# Altium schematic sheet control_logic.SchDoc
size Letter
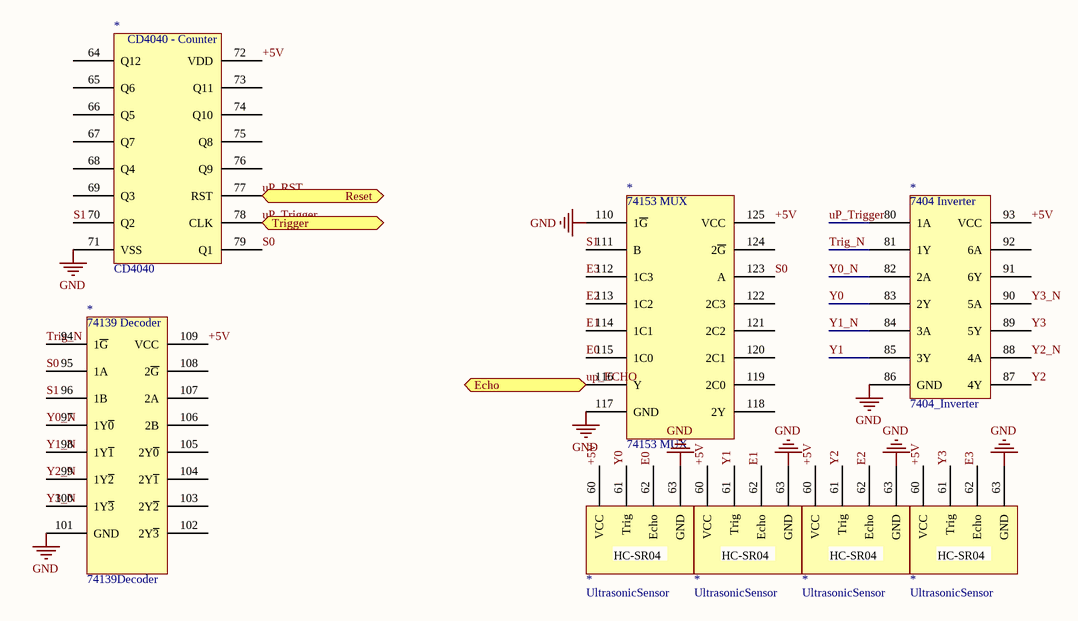
[diagram p0: control_logic.SchDoc]

## Parts
(Parts that share a designator on the sheet are numbered #1, #2 ... from top to bottom, then left to right.)
*#1  CD4040
*#2  7404_Inverter
*#3  74153 MUX
*#4  74139Decoder
*#5  UltrasonicSensor  [Model Name]
*#6  UltrasonicSensor  [Model Name]
*#7  UltrasonicSensor  [Model Name]
*#8  UltrasonicSensor  [Model Name]

## Ports
Echo (out), Reset, Trigger

## Nets
GND: *#1.71(VSS) *#2.86(GND) *#3.110(1~{G}) *#3.117(GND) *#4.101(GND) *#5.63(GND) *#6.63(GND) *#7.63(GND) *#8.63(GND)
+5V: *#1.72(VDD) *#2.93(VCC) *#3.125(VCC) *#4.109(VCC) *#5.60(VCC) *#6.60(VCC) *#7.60(VCC) *#8.60(VCC)
E0: *#3.115(1C0) *#5.62(Echo)
E1: *#3.114(1C1) *#6.62(Echo)
E2: *#3.113(1C2) *#7.62(Echo)
E3: *#3.112(1C3) *#8.62(Echo)
S0: *#1.79(Q1) *#3.123(A) *#4.95(1A)
S1: *#1.70(Q2) *#3.111(B) *#4.96(1B)
Trig_N: *#2.81(1Y) *#4.94(1~{G})
up_ECHO: *#3.116(Y) ; port Echo
uP_RST: *#1.77(RST) ; port Reset
uP_Trigger: *#1.78(CLK) *#2.80(1A) ; port Trigger
Y0: *#2.83(2Y) *#5.61(Trig)
Y0_N: *#2.82(2A) *#4.97(1Y~{0})
Y1: *#2.85(3Y) *#6.61(Trig)
Y1_N: *#2.84(3A) *#4.98(1Y~{1})
Y2: *#2.87(4Y) *#7.61(Trig)
Y2_N: *#2.88(4A) *#4.99(1Y~{2})
Y3: *#2.89(5Y) *#8.61(Trig)
Y3_N: *#2.90(5A) *#4.100(1Y~{3})

Not connected (* = marked no-connect by the designer): *#1 64(Q12) 65(Q6) 66(Q5) 67(Q7) 68(Q4) 69(Q3) 73(Q11) 74(Q10) 75(Q8) 76(Q9); *#2 91(6Y) 92(6A); *#3 118(2Y) 119(2C0) 120(2C1) 121(2C2) 122(2C3) 124(2~{G}); *#4 102(2Y~{3}) 103(2Y~{2}) 104(2Y~{1}) 105(2Y~{0}) 106(2B) 107(2A) 108(2~{G})

## Notes on the sheet
- (in symbol 7404_Inverter) 7404 Inverter
- (in symbol 74139Decoder) 74139 Decoder
- (in symbol CD4040) CD4040 - Counter
- (in symbol UltrasonicSensor) HC-SR04